# EAGLE design EMS esp32 wifi lora gsm v2.7 (EAGLE 9.5.2)
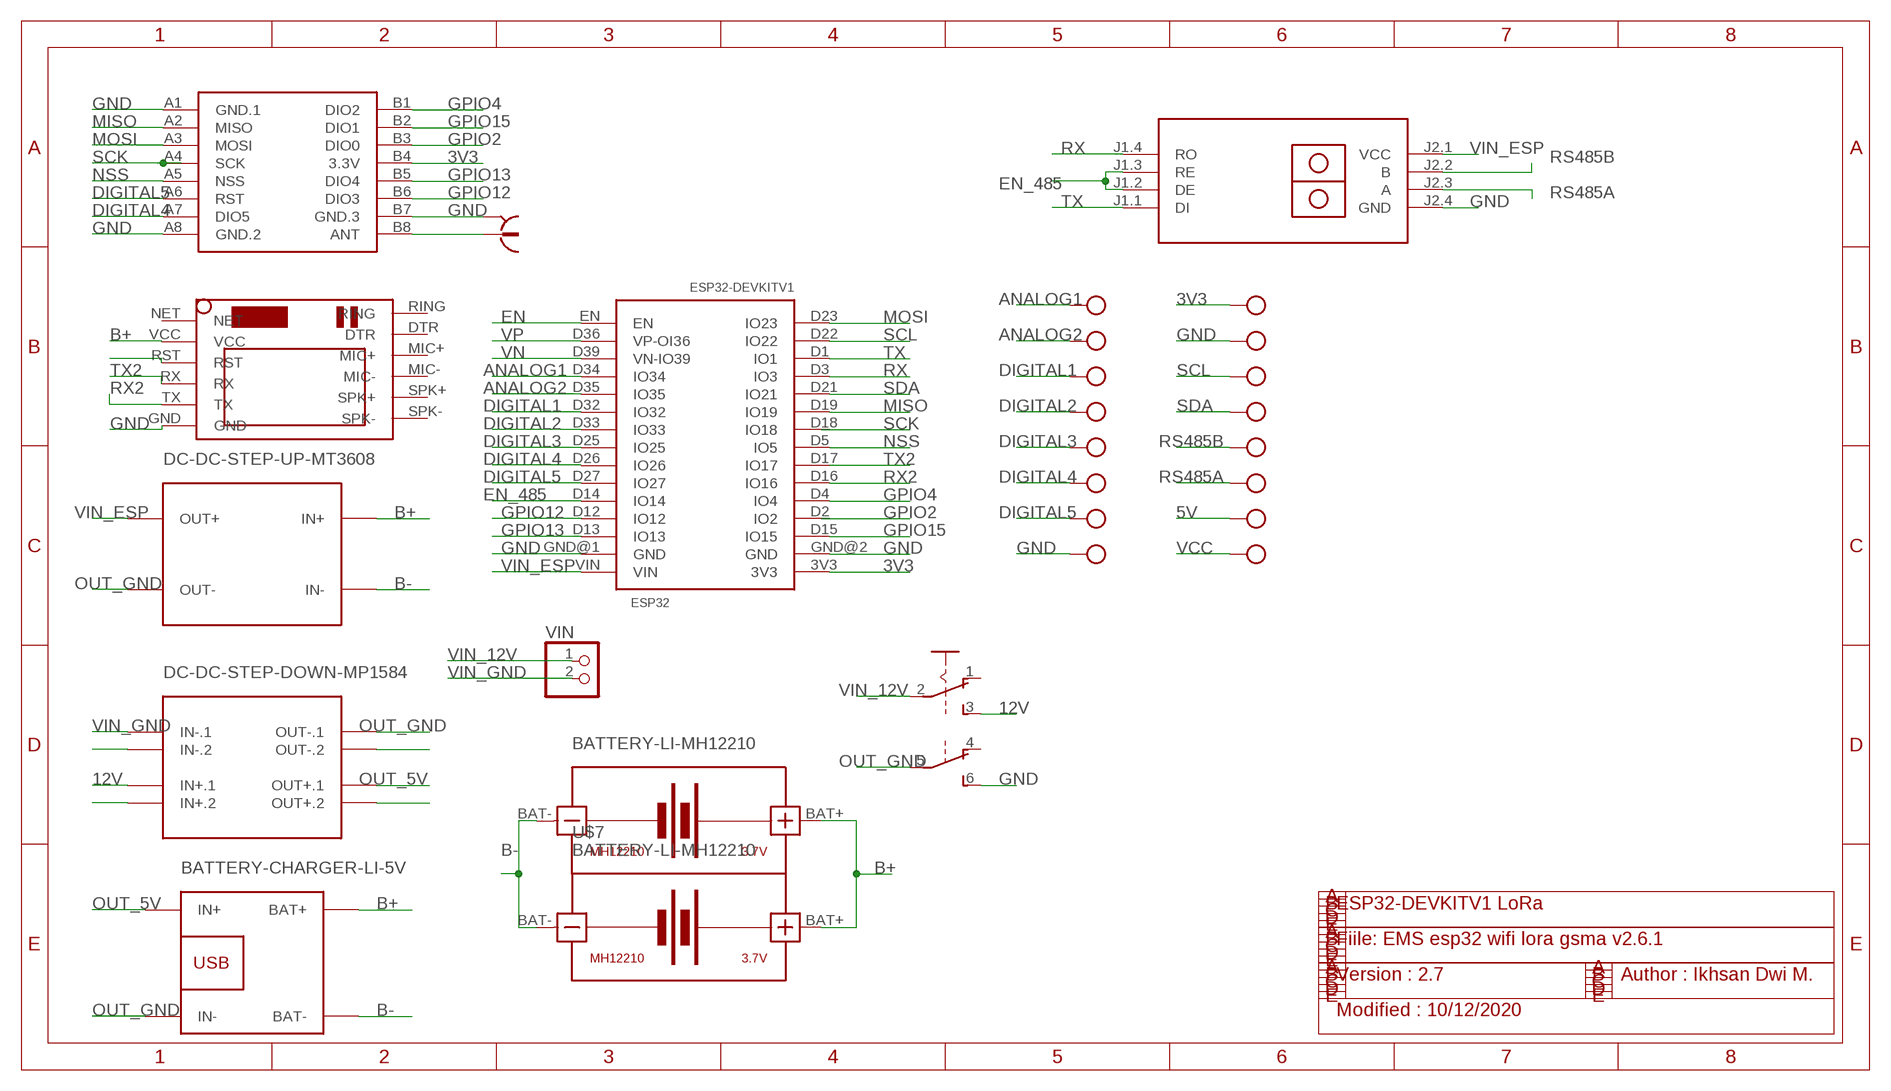
[diagram p0: schematic, sheet 1]

## Parts
ESP32  ESP32DEVKITV1  [ESP32-DEVKITV1]
S1  A68-A31  [A68-A31]
U$1  RS485-TTL-CONVERTER  [RS485-TTL-CONVERTER]
U$2  DC-DC-STEP-UP-MT3608  [DC-DC-STEP-UP-MT3608]
U$3  DC-DC-STEP-DOWN-MP1584  [DC-DC-STEP-DOWN-MP1584]
U$4  BATTERY-CHARGER-LI-5V  [BATTERY-CHARGER-LI-5V]
U$5  WIRELESS-LORA-RFM95W#SMD  [WIRELESS-LORA-RFM95W#SMD]
U$6  BATTERY-LI-MH12210  [BATTERY-LI-MH12210]
U$7  BATTERY-LI-MH12210  [BATTERY-LI-MH12210]
U$9  SIM800LMODULE  [SIM800LMODULE]
VIN  PINHD-1X2  [1X02]
X1  734120110  [734120110]
X2  MKDSN1,5/2-5,08  [MKDSN1,5/2-5,08]
X3  MKDSN1,5/2-5,08  [MKDSN1,5/2-5,08]
X4  MKDSN1,5/2-5,08  [MKDSN1,5/2-5,08]
X5  MKDSN1,5/2-5,08  [MKDSN1,5/2-5,08]
X6  MKDSN1,5/2-5,08  [MKDSN1,5/2-5,08]
X7  MKDSN1,5/2-5,08  [MKDSN1,5/2-5,08]
X8  MKDSN1,5/2-5,08  [MKDSN1,5/2-5,08]
X9  MKDSN1,5/2-5,08  [MKDSN1,5/2-5,08]

## Nets
3V3: ESP32.3V3 U$5.B4(3.3V) X4.1
5V [usbvcc]: X9.1
12V [usbvcc]: S1.3(A:S) U$3.IN+.1
ANALOG1: ESP32.D34(IO34) X2.1
ANALOG2: ESP32.D35(IO35) X2.2
B+: U$2.IN+ U$4.BAT+ U$6.BAT+ U$7.BAT+ U$9.VCC
B-: U$2.IN- U$4.BAT- U$6.BAT- U$7.BAT-
DIGITAL1: ESP32.D32(IO32) X3.1
DIGITAL2: ESP32.D33(IO33) X3.2
DIGITAL3: ESP32.D25(IO25) X5.1
DIGITAL4: ESP32.D26(IO26) U$5.A7(DIO5) X5.2
DIGITAL5: ESP32.D27(IO27) U$5.A6(RST) X6.1
EN: ESP32.EN
EN_485: ESP32.D14(IO14) U$1.J1.2(DE) U$1.J1.3(RE)
GND: ESP32.GND@1(GND) ESP32.GND@2(GND) S1.6(B:S) U$1.J2.4(GND) U$5.A1(GND.1) U$5.A8(GND.2) U$5.B7(GND.3) U$9.GND X1.S@1 X1.S@2 X1.S@3 X4.2 X6.2
GPIO2: ESP32.D2(IO2) U$5.B3(DIO0)
GPIO4: ESP32.D4(IO4) U$5.B1(DIO2)
GPIO12: ESP32.D12(IO12) U$5.B6(DIO3)
GPIO13: ESP32.D13(IO13) U$5.B5(DIO4)
GPIO15: ESP32.D15(IO15) U$5.B2(DIO1)
MISO: ESP32.D19(IO19) U$5.A2(MISO)
MOSI: ESP32.D23(IO23) U$5.A3(MOSI)
N$2: U$9.RST
N$7: U$3.IN-.2
N$8: U$5.B8(ANT) X1.1
N$10: U$3.IN+.2
N$12: U$3.OUT-.2
N$14: U$3.OUT+.2
NSS: ESP32.D5(IO5) U$5.A5(NSS)
OUT_5V: U$3.OUT+.1 U$4.IN+
OUT_GND: S1.5(B:P) U$2.OUT- U$3.OUT-.1 U$4.IN-
RS485A: U$1.J2.3(A) X8.2
RS485B: U$1.J2.2(B) X8.1
RX: ESP32.D3(IO3) U$1.J1.4(RO)
RX2: ESP32.D16(IO16) U$9.TX
SCK: ESP32.D18(IO18) U$5.A4(SCK)
SCL: ESP32.D22(IO22) X7.1
SDA: ESP32.D21(IO21) X7.2
TX: ESP32.D1(IO1) U$1.J1.1(DI)
TX2: ESP32.D17(IO17) U$9.RX
VCC: X9.2
VIN_12V [usbvcc]: S1.2(A:P) VIN.1
VIN_ESP [usbvcc]: ESP32.VIN U$1.J2.1(VCC) U$2.OUT+
VIN_GND [usbvcc]: U$3.IN-.1 VIN.2
VN: ESP32.D39(VN-IO39)
VP: ESP32.D36(VP-OI36)
Unconnected: S1.1(A:O) S1.4(B:O) U$9.DTR U$9.MIC+ U$9.MIC- U$9.NET U$9.RING U$9.SPK+ U$9.SPK-

## Notes on the sheet
- ESP32-DEVKITV1 LoRa
- Fiile: EMS esp32 wifi lora gsma v2.6.1
- Version : 2.7 | Author : Ikhsan Dwi M.
- Modified : 10/12/2020

## Library data of the parts
ESP32 = ESP32-DEVKITV1:ESP32DEVKITV1
S1 = switch:A68-A31: SLIDING SWITCH Siemens, distributor Buerklin, 11G766
U$1 = diy-modules:RS485-TTL-CONVERTER: RS485 to TTL converter based on MAX485 chip
U$2 = diy-modules:DC-DC-STEP-UP-MT3608: DC/DC Step-Up Regulator based on MT3608 chip MT3608 datasheet available here: https://www.olimex.com/Products/Breadboarding/BB-PWR-3608/resources/MT3608.pdf Click here to find device on ebay.com <http://www.ebay.com/sch/mt3608+module>
U$3 = diy-modules:DC-DC-STEP-DOWN-MP1584: DC/DC Step-Down Regulator based on MP1584 chip MP1584 datasheet available here: http://www.haoyuelectronics.com/Attachment/MP1584/MP1584.pdf Click here to find device on ebay.com <http://www.ebay.com/sch/mp1584+module>
U$4 = diy-modules:BATTERY-CHARGER-LI-5V: Lithium Battery 5V Charger More details available here: http://www.buildcircuit.com/how-to-use-micro-usb-5v-1a-lithium-battery-charging-board-charger-module/ Click here to find device on ebay.com <http://www.ebay.com/sch/tp4056+charger+usb>
U$5 = diy-modules:WIRELESS-LORA-RFM95W: 868/915 MHz LoRa Radio Transceiver Module based on SX1276 chip Click here to find device on ebay.com <http://www.ebay.com/sch/RFM95W+transceiver>
U$6 U$7 = diy-modules:BATTERY-LI-MH12210: Lithium-Ion MH12210 Rechargeable Battery Panasonic NCR18650PF battery datasheet available here: https://industrial.panasonic.com/cdbs/www-data/pdf2/ACI4000/ACI4000C12.pdf Click here to find device on ebay.com <http://www.ebay.com/sch/ncr18650b+battery>
U$9 = SIM800LMODULE:SIM800LMODULE: SIM800L Module
VIN = pinhead:PINHD-1X2: PIN HEADER
X1 = con-coax:734120110: MICRO COAXIAL CONNECTOR RECEPTACLE VERTICAL Source: Data sheet <http://www.molex.com/pdm_docs/sd/734120110_sd.pdf>
X2-X9 = con-phoenix-508:MKDSN1,5/2-5,08: MKDSN 1,5/ 2-5,08 Printklemme Nennstrom: 13,5 A Nennspannung: 250 V Rastermaß: 5,08 mm Polzahl: 2 Anschlussart: Schraubanschluss Montage: Löten Anschlussrichtung Leiter/Platine: 0 ° Artikelnummer: 1729128 Source: http://eshop.phoenixcontact.com .. 1729128.pdf

## Net classes
1 power: width 0.61 mm, drill 0.508 mm, clearance 0.152 mm
2 gnd: width 0.305 mm, drill 0.508 mm, clearance 0.152 mm
3 usbvcc: width 0.508 mm, drill 0.508 mm, clearance 0.152 mm

## Board
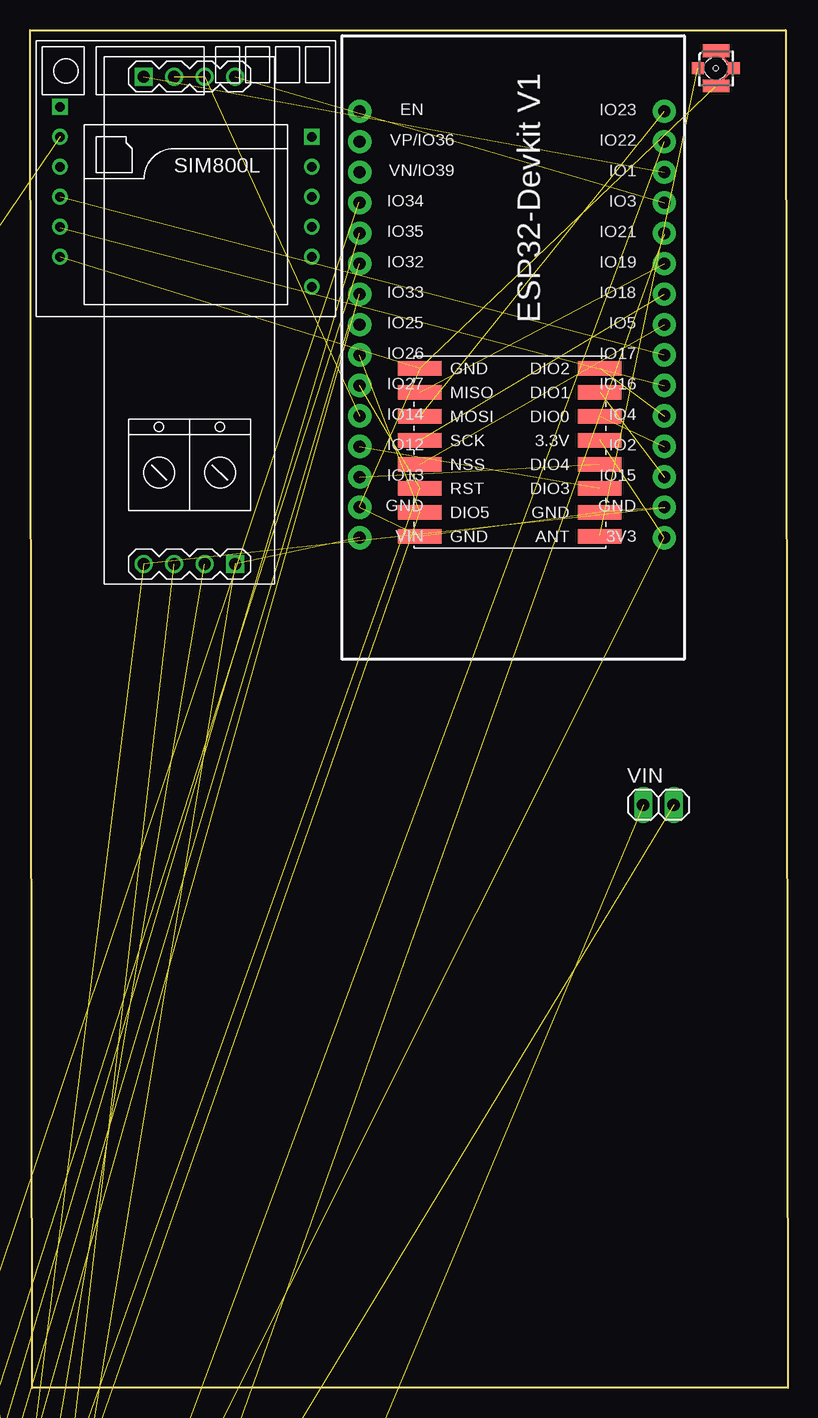
[diagram p1: board, top side]
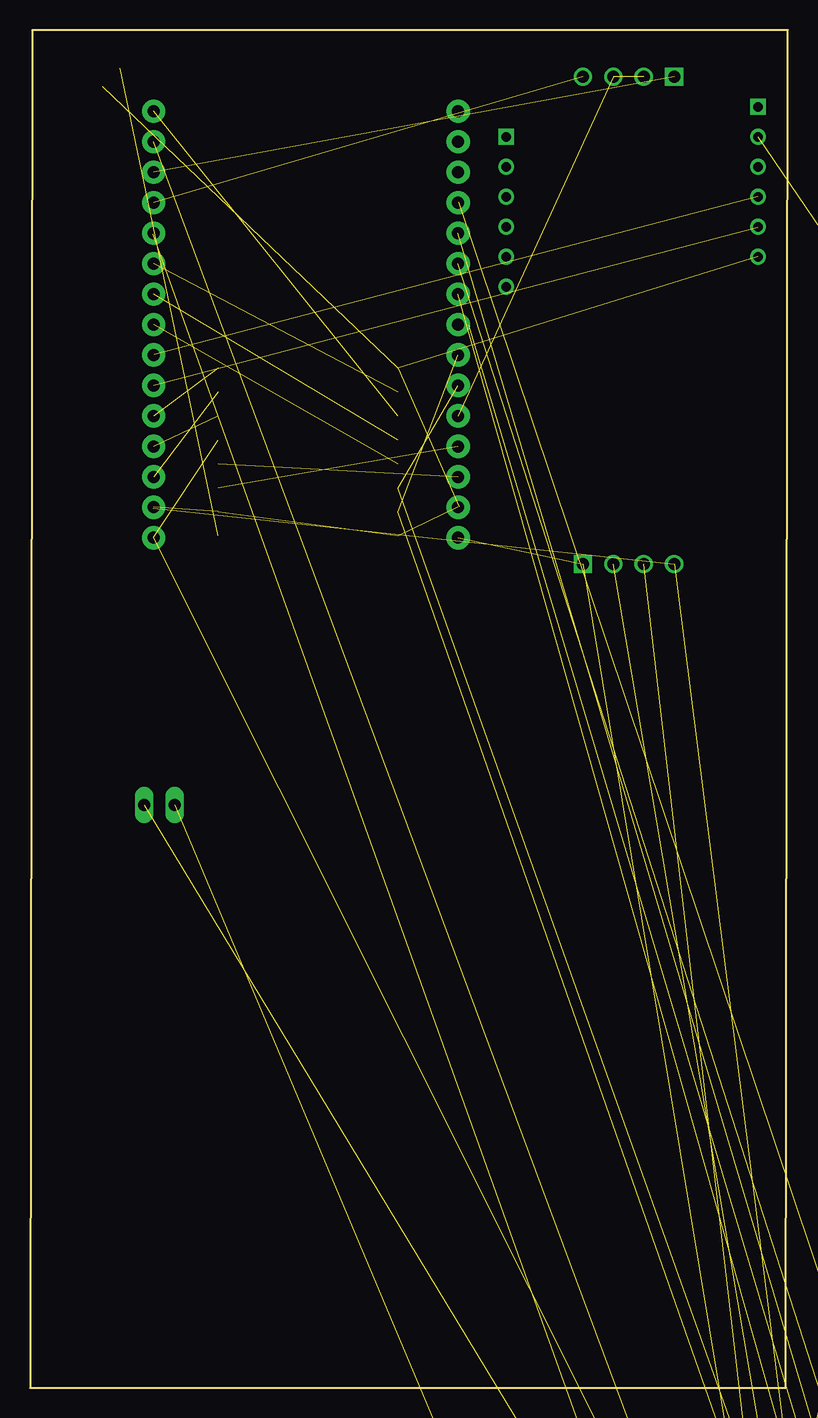
[diagram p2: board, bottom side, seen from below]

Size 63.2 x 113.2 mm. Coordinates in mm from the lower left corner, seen from the top.
Outline: 0,113.2 63,113.2 63.2,0 0.2,0 0,113.2
Copper layers (1*16): Top 0.035mm / dielectric 1.5mm / Bottom 0.035mm
Design rules "default": minimum track width 6mil, minimum drill 0.35mm, track to track 6mil, track to pad 6mil, pad to pad 6mil, via to via 6mil, smd to smd 6mil, copper to edge 40mil, drill to drill 6mil, minimum pad ring 10mil, minimum via ring 8mil, stop-mask expansion 4mil, vias tented up to drill 0mil, thermal gap 10mil

### Footprints (pad centres in the part's own frame; a part is rotated, then mirrored left to right if it is on the bottom)
ESP32-DEVKITV1 = drill 1 pad 1.93: 3V3 -16.52,-12.27; D1 13.96,-12.27; D2 -8.9,-12.27; D3 11.42,-12.27; D4 -6.36,-12.27; D5 1.26,-12.27; D12 -8.9,13.135; D13 -11.44,13.135; D14 -6.36,13.135; D15 -11.44,-12.27; D16 -3.82,-12.27; D17 -1.28,-12.27; D18 3.8,-12.27; D19 6.34,-12.27; D21 8.88,-12.27; D22 16.5,-12.27; D23 19.04,-12.27; D25 1.26,13.135; D26 -1.28,13.135; D27 -3.82,13.135; D32 6.34,13.135; D33 3.8,13.135; D34 11.42,13.135; D35 8.88,13.135; D36 16.5,13.135; D39 13.96,13.135; EN 19.04,13.135; GND@1 -13.98,13.135; GND@2 -13.98,-12.27; VIN -16.52,13.135
A68-A31 = drill 0.813 long: 1 -2.54,-2.54; 2 0,-2.54; 3 2.54,-2.54; 4 -2.54,2.54; 5 0,2.54; 6 2.54,2.54
RS485-TTL-CONVERTER = drill 1 square: J1.1 -20.32,-3.81; J2.1 20.32,3.81 | drill 1: J1.2 -20.32,-1.27; J1.3 -20.32,1.27; J1.4 -20.32,3.81; J2.2 20.32,1.27; J2.3 20.32,-1.27; J2.4 20.32,-3.81
DC-DC-STEP-UP-MT3608 = drill 2 pad 2.8 square: IN+ 15.24,3.81; IN- 15.24,-3.81; OUT+ -15.24,3.81; OUT- -15.24,-3.81
DC-DC-STEP-DOWN-MP1584 = drill 1.2 pad 2 square: IN+.1 -9.271,-4.064; IN+.2 -9.271,-6.604; OUT+.1 9.271,-4.064; OUT+.2 9.271,-6.604 | drill 1.2 pad 2: IN-.1 -9.271,6.604; IN-.2 -9.271,4.064; OUT-.1 9.271,6.604; OUT-.2 9.271,4.064
BATTERY-CHARGER-LI-5V = drill 1.2 pad 3 square: BAT+ 10.795,8.255; BAT- 10.795,-7.62; IN+ -10.795,8.255; IN- -10.795,-7.62
WIRELESS-LORA-RFM95W#SMD = smd 3.6 x 1.2: A1 -7.5,7; A2 -7.5,5; A3 -7.5,3; A4 -7.5,1; A5 -7.5,-1; A6 -7.5,-3; A7 -7.5,-5; A8 -7.5,-7; B1 7.5,7; B2 7.5,5; B3 7.5,3; B4 7.5,1; B5 7.5,-1; B6 7.5,-3; B7 7.5,-5; B8 7.5,-7
BATTERY-LI-MH12210 = drill 1.5 pad 3 square: BAT+ -33.02,0 | drill 1.5 pad 3: BAT- 33.02,0
SIM800LMODULE = drill 0.8: DTR 10.5,1; GND -10.5,-6.5; MIC+ 10.5,-1.5; MIC- 10.5,-4; RST -10.5,1; RX -10.5,-1.5; SPK+ 10.5,-6.5; SPK- 10.5,-9; TX -10.5,-4; VCC -10.5,3.5 | drill 0.8 square: NET -10.5,6; RING 10.5,3.5
1X02 = drill 1.016 long: 1 -1.27,0; 2 1.27,0
734120110 = smd 1 x 1: 1 0,-1.5; S@1 0,1.5 | smd 1.05 x 2.2: S@2 -1.475,0; S@3 1.475,0
MKDSN1,5/2-5,08 = drill 1.3 pad 2: 1 -2.561,0.025; 2 2.519,0.025

### Placement (x,y rotation side)
ESP32  40.63,87.39 90 top
S1  -31.4,-145 0 top  (outside the outline)
U$1  13.3,89 270 top
U$2  4.8,-101.8 0 top  (outside the outline)
U$3  -24.2,-101.8 0 top  (outside the outline)
U$4  -22.4,-126.4 0 top  (outside the outline)
U$5  40,78 0 top
U$6  -26.4,74.2 90 bottom  (outside the outline)
U$7  -40.6,74 90 bottom  (outside the outline)
U$9  13,100.8 0 top
VIN  52.4,48.6 0 top
X1  57.2,110 270 top
X2  -7.2,-11.8 0 top  (outside the outline)
X3  -7.2,-22.4 0 top  (outside the outline)
X4  -7.2,-54.2 0 top  (outside the outline)
X5  -7.2,-33 0 top  (outside the outline)
X6  -7.2,-43.6 0 top  (outside the outline)
X7  -7.2,-64.8 0 top  (outside the outline)
X8  -7.2,-75.4 0 top  (outside the outline)
X9  -7.2,-86 0 top  (outside the outline)

### Tracks (layer width: path | path; a pad name or v marks a point on that pad's centre or on a via)
3V3  (2 unrouted)
  Top 0.152: 52.87,70.94 ESP32.3V3
12V  (1 unrouted)
ANALOG1  (1 unrouted)
  Top 0.152: 27.42,98.83 ESP32.D34
ANALOG2  (1 unrouted)
  Top 0.152: 27.42,96.31 ESP32.D35
B+  (4 unrouted)
B-  (3 unrouted)
DIGITAL1  (1 unrouted)
  Top 0.152: 27.42,93.8 ESP32.D32
DIGITAL2  (1 unrouted)
  Top 0.152: 27.42,91.21 ESP32.D33
DIGITAL3  (1 unrouted)
  Top 0.152: 27.42,88.69 ESP32.D25
  Top 0.305: ESP32.D25 27.44,88.6 26.6,88.6
DIGITAL4  (2 unrouted)
  Top 0.152: 27.42,86.18 ESP32.D26
DIGITAL5  (2 unrouted)
  Top 0.152: 27.42,83.59 ESP32.D27
EN
  Top 0.152: 27.42,106.45 ESP32.EN
EN_485  (2 unrouted)
  Top 0.152: 27.42,81.07 ESP32.D14
GND  (10 unrouted)
  Top 0.152: 27.42,73.45 ESP32.GND@1 | X1.S@2 57.27,111.44 58.64,110.07 X1.S@1 58.71,109.99 57.27,108.54 X1.S@3 | 52.92,73.42 ESP32.GND@2 | 47.51,73.03 U$5.B7
  Bottom 0.152: 52.92,73.34 ESP32.GND@2
GPIO2  (1 unrouted)
GPIO4  (1 unrouted)
GPIO12  (1 unrouted)
  Top 0.152: 27.42,78.56 ESP32.D12
GPIO13  (1 unrouted)
  Top 0.152: 27.42,75.97 ESP32.D13
GPIO15  (1 unrouted)
MISO  (1 unrouted)
MOSI  (1 unrouted)
  Top 0.152: 52.95,106.45 ESP32.D23
N$8  (1 unrouted)
  Top 0.152: 47.51,71.05 U$5.B8
NSS  (1 unrouted)
OUT_5V  (1 unrouted)
OUT_GND  (3 unrouted)
RS485A  (1 unrouted)
RS485B  (1 unrouted)
RX  (1 unrouted)
  Top 0.152: 52.95,98.83 ESP32.D3
RX2  (1 unrouted)
  Bottom 0.152: 2.52,96.73 U$9.TX
SCK  (1 unrouted)
SCL  (1 unrouted)
  Top 0.152: 52.95,103.93 ESP32.D22
SDA  (1 unrouted)
  Top 0.152: 52.95,96.31 ESP32.D21
  Bottom 0.152: 52.92,96.2 ESP32.D21
TX  (1 unrouted)
  Top 0.152: 52.95,101.34 ESP32.D1
TX2  (1 unrouted)
  Bottom 0.152: 52.85,86.14 ESP32.D17
VIN_12V  (1 unrouted)
VIN_ESP  (2 unrouted)
VIN_GND  (1 unrouted)
VN
  Top 0.152: 27.42,101.42 ESP32.D39
VP
  Top 0.152: 27.42,103.93 ESP32.D36